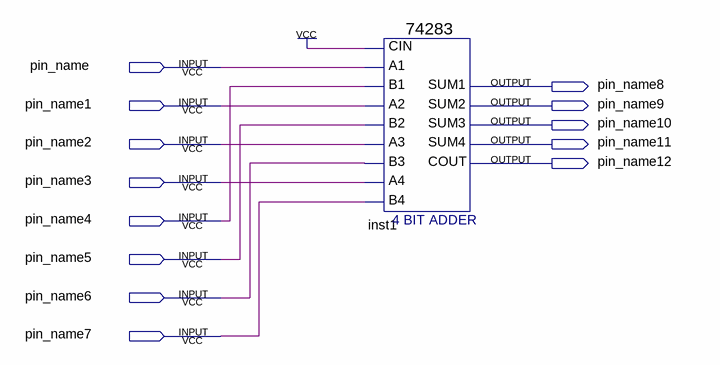
[diagram p0: schematic sheet]
// Quartus schematic plus.bdf as structural Verilog: 1 symbols, 13 pins
module plus (
  input  pin_name,
  input  pin_name1,
  input  pin_name2,
  input  pin_name3,
  input  pin_name4,
  input  pin_name5,
  input  pin_name6,
  input  pin_name7,
  output pin_name8,
  output pin_name9,
  output pin_name10,
  output pin_name11,
  output pin_name12
);

  \74283  inst1 (
    .CIN(1'b1), .A1(pin_name), .A2(pin_name1), .B2(pin_name5), .A3(pin_name2), .A4(pin_name3),
    .B4(pin_name7), .B1(pin_name4), .B3(pin_name6), .SUM4(pin_name11), .COUT(pin_name12), .SUM1(pin_name8),
    .SUM2(pin_name9), .SUM3(pin_name10));
endmodule
